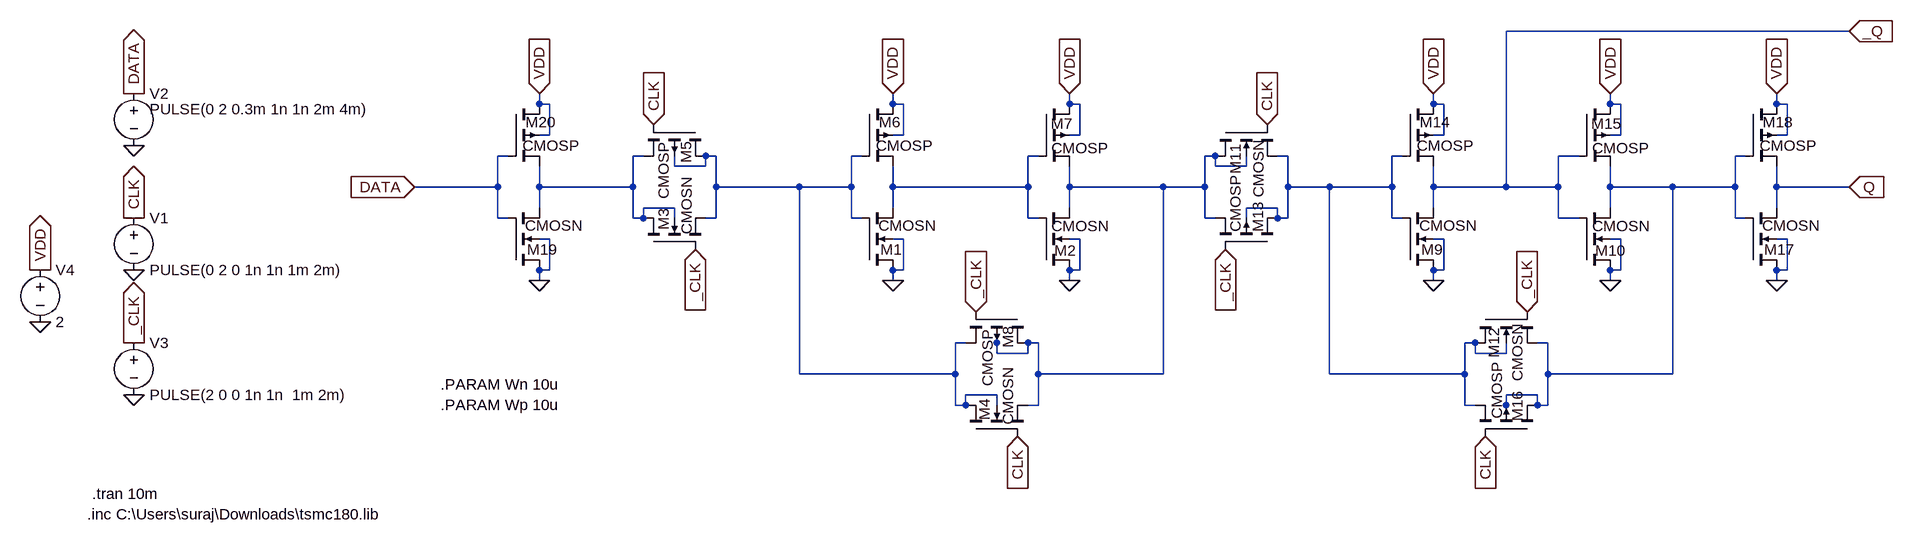
[diagram p0: schematic D_FF.asc]
D_FF.asc, the LTspice schematic file:
Version 4
SHEET 1 1920 680
WIRE 1808 -128 1280 -128
WIRE -208 -16 -208 -32
WIRE -192 -16 -208 -16
WIRE 336 -16 336 -32
WIRE 352 -16 336 -16
WIRE 608 -16 608 -32
WIRE 624 -16 608 -16
WIRE 1168 -16 1168 -32
WIRE 1184 -16 1168 -16
WIRE 1440 -16 1440 -32
WIRE 1456 -16 1440 -16
WIRE 1696 -16 1696 -32
WIRE 1712 -16 1696 -16
WIRE -208 0 -208 -16
WIRE 336 0 336 -16
WIRE 608 0 608 -16
WIRE 1168 0 1168 -16
WIRE 1440 0 1440 -16
WIRE 1696 0 1696 -16
WIRE -192 32 -192 -16
WIRE -192 32 -208 32
WIRE 352 32 352 -16
WIRE 352 32 336 32
WIRE 624 32 624 -16
WIRE 624 32 608 32
WIRE 1184 32 1184 -16
WIRE 1184 32 1168 32
WIRE 1456 32 1456 -16
WIRE 1456 32 1440 32
WIRE 1712 32 1712 -16
WIRE 1712 32 1696 32
WIRE -256 64 -272 64
WIRE -48 64 -64 64
WIRE 64 64 48 64
WIRE 288 64 272 64
WIRE 560 64 544 64
WIRE 832 64 816 64
WIRE 944 64 928 64
WIRE 1120 64 1104 64
WIRE 1392 64 1360 64
WIRE 1648 64 1632 64
WIRE 0 80 0 64
WIRE 48 80 48 64
WIRE 48 80 0 80
WIRE 832 80 832 64
WIRE 880 80 880 64
WIRE 880 80 832 80
WIRE -272 112 -272 64
WIRE -272 112 -400 112
WIRE -208 112 -208 80
WIRE -64 112 -64 64
WIRE -64 112 -208 112
WIRE 64 112 64 64
WIRE 192 112 64 112
WIRE 272 112 272 64
WIRE 272 112 192 112
WIRE 336 112 336 80
WIRE 544 112 544 64
WIRE 544 112 336 112
WIRE 608 112 608 80
WIRE 752 112 608 112
WIRE 816 112 816 64
WIRE 816 112 752 112
WIRE 944 112 944 64
WIRE 1008 112 944 112
WIRE 1104 112 1104 64
WIRE 1104 112 1008 112
WIRE 1168 112 1168 80
WIRE 1280 112 1280 -128
WIRE 1280 112 1168 112
WIRE 1360 112 1360 64
WIRE 1360 112 1280 112
WIRE 1440 112 1440 80
WIRE 1536 112 1440 112
WIRE 1632 112 1632 64
WIRE 1632 112 1536 112
WIRE 1696 112 1696 80
WIRE 1808 112 1696 112
WIRE -208 144 -208 112
WIRE 0 144 -48 144
WIRE 336 144 336 112
WIRE 608 144 608 112
WIRE 928 144 880 144
WIRE 1168 144 1168 112
WIRE 1440 144 1440 112
WIRE 1696 144 1696 112
WIRE -272 160 -272 112
WIRE -256 160 -272 160
WIRE -64 160 -64 112
WIRE -48 160 -48 144
WIRE -48 160 -64 160
WIRE 0 160 0 144
WIRE 64 160 64 112
WIRE 64 160 48 160
WIRE 272 160 272 112
WIRE 288 160 272 160
WIRE 544 160 544 112
WIRE 560 160 544 160
WIRE 816 160 816 112
WIRE 832 160 816 160
WIRE 880 160 880 144
WIRE 928 160 928 144
WIRE 944 160 944 112
WIRE 944 160 928 160
WIRE 1104 160 1104 112
WIRE 1120 160 1104 160
WIRE 1360 160 1360 112
WIRE 1392 160 1360 160
WIRE 1632 160 1632 112
WIRE 1648 160 1632 160
WIRE -192 192 -208 192
WIRE 352 192 336 192
WIRE 624 192 608 192
WIRE 1184 192 1168 192
WIRE 1456 192 1440 192
WIRE 1712 192 1696 192
WIRE -192 240 -192 192
WIRE -192 240 -208 240
WIRE 352 240 352 192
WIRE 352 240 336 240
WIRE 608 240 608 224
WIRE 624 240 624 192
WIRE 624 240 608 240
WIRE 1184 240 1184 192
WIRE 1184 240 1168 240
WIRE 1440 240 1440 224
WIRE 1456 240 1456 192
WIRE 1456 240 1440 240
WIRE 1712 240 1712 192
WIRE 1712 240 1696 240
WIRE -208 256 -208 240
WIRE 336 256 336 240
WIRE 608 256 608 240
WIRE 1168 256 1168 240
WIRE 1440 256 1440 240
WIRE 1696 256 1696 240
WIRE 448 352 432 352
WIRE 496 352 496 336
WIRE 560 352 544 352
WIRE 1232 352 1216 352
WIRE 1344 352 1328 352
WIRE 496 368 496 352
WIRE 544 368 544 352
WIRE 544 368 496 368
WIRE 1232 368 1232 352
WIRE 1280 368 1280 352
WIRE 1280 368 1232 368
WIRE 192 400 192 112
WIRE 432 400 432 352
WIRE 432 400 192 400
WIRE 560 400 560 352
WIRE 752 400 752 112
WIRE 752 400 560 400
WIRE 1008 400 1008 112
WIRE 1216 400 1216 352
WIRE 1216 400 1008 400
WIRE 1344 400 1344 352
WIRE 1536 400 1536 112
WIRE 1536 400 1344 400
WIRE 496 432 448 432
WIRE 1328 432 1280 432
WIRE 432 448 432 400
WIRE 448 448 448 432
WIRE 448 448 432 448
WIRE 496 448 496 432
WIRE 560 448 560 400
WIRE 560 448 544 448
WIRE 1216 448 1216 400
WIRE 1232 448 1216 448
WIRE 1280 448 1280 432
WIRE 1328 448 1328 432
WIRE 1344 448 1344 400
WIRE 1344 448 1328 448
WIRE 1280 464 1280 448
FLAG 608 256 0
FLAG 336 256 0
FLAG 336 -32 VDD
IOPIN 336 -32 In
FLAG 608 -32 VDD
IOPIN 608 -32 In
FLAG -400 112 DATA
IOPIN -400 112 In
FLAG 528 496 CLK
IOPIN 528 496 In
FLAG 464 304 _CLK
IOPIN 464 304 In
FLAG 32 208 _CLK
IOPIN 32 208 In
FLAG -32 16 CLK
IOPIN -32 16 In
FLAG -832 240 0
FLAG -832 48 0
FLAG -832 -32 DATA
IOPIN -832 -32 Out
FLAG -832 160 CLK
IOPIN -832 160 Out
FLAG -832 352 _CLK
IOPIN -832 352 Out
FLAG -832 432 0
FLAG -976 320 0
FLAG -976 240 VDD
IOPIN -976 240 Out
FLAG 1440 256 0
FLAG 1168 256 0
FLAG 1168 -32 VDD
IOPIN 1168 -32 In
FLAG 1440 -32 VDD
IOPIN 1440 -32 In
FLAG 1808 -128 _Q
IOPIN 1808 -128 In
FLAG 1808 112 Q
IOPIN 1808 112 In
FLAG 1312 304 _CLK
IOPIN 1312 304 In
FLAG 1248 496 CLK
IOPIN 1248 496 In
FLAG 912 16 CLK
IOPIN 912 16 In
FLAG 848 208 _CLK
IOPIN 848 208 In
FLAG 1696 256 0
FLAG 1696 -32 VDD
IOPIN 1696 -32 In
FLAG -208 256 0
FLAG -208 -32 VDD
IOPIN -208 -32 In
SYMBOL nmos4 288 240 M180
WINDOW 0 29 32 Left 2
WINDOW 3 26 69 Left 2
SYMATTR InstName M1
SYMATTR Value CMOSN
SYMATTR Value2 l=0.18u w=Wn
SYMBOL nmos4 560 240 M180
WINDOW 0 25 30 Left 2
WINDOW 3 20 68 Left 2
SYMATTR InstName M2
SYMATTR Value CMOSN
SYMATTR Value2 l=0.18u w=Wn
SYMBOL nmos4 -48 208 R270
WINDOW 0 29 31 Left 2
WINDOW 3 23 67 Left 2
SYMATTR InstName M3
SYMATTR Value CMOSN
SYMATTR Value2 l=0.18u w=Wn
SYMBOL nmos4 448 496 R270
WINDOW 0 24 29 Left 2
WINDOW 3 18 65 Left 2
SYMATTR InstName M4
SYMATTR Value CMOSN
SYMATTR Value2 l=0.18u w=Wn
SYMBOL pmos4 48 16 R90
WINDOW 0 26 30 Left 2
WINDOW 3 27 65 Left 2
SYMATTR InstName M5
SYMATTR Value CMOSP
SYMATTR Value2 l=0.18u w=Wp
SYMBOL pmos4 288 -16 R0
WINDOW 0 27 28 Left 2
WINDOW 3 22 64 Left 2
SYMATTR InstName M6
SYMATTR Value CMOSP
SYMATTR Value2 l=0.18u w=Wp
SYMBOL pmos4 560 -16 R0
WINDOW 0 19 30 Left 2
WINDOW 3 20 68 Left 2
SYMATTR InstName M7
SYMATTR Value CMOSP
SYMATTR Value2 l=0.18u w=Wp
SYMBOL pmos4 544 304 R90
WINDOW 0 23 31 Left 2
WINDOW 3 27 62 Left 2
SYMATTR InstName M8
SYMATTR Value CMOSP
SYMATTR Value2 l=0.18u w=Wp
SYMBOL voltage -832 144 R0
WINDOW 123 0 0 Left 0
WINDOW 39 0 0 Left 0
SYMATTR InstName V1
SYMATTR Value PULSE(0 2 0 1n 1n 1m 2m)
SYMBOL voltage -832 -48 R0
WINDOW 3 24 40 Left 2
WINDOW 123 0 0 Left 0
WINDOW 39 0 0 Left 0
SYMATTR Value PULSE(0 2 0.3m 1n 1n 2m 4m)
SYMATTR InstName V2
SYMBOL voltage -832 336 R0
WINDOW 123 0 0 Left 0
WINDOW 39 0 0 Left 0
SYMATTR InstName V3
SYMATTR Value PULSE(2 0 0 1n 1n  1m 2m)
SYMBOL voltage -976 224 R0
WINDOW 123 0 0 Left 0
WINDOW 39 0 0 Left 0
SYMATTR InstName V4
SYMATTR Value 2
SYMBOL nmos4 1120 240 M180
WINDOW 0 29 32 Left 2
WINDOW 3 26 69 Left 2
SYMATTR InstName M9
SYMATTR Value CMOSN
SYMATTR Value2 l=0.18u w=Wn
SYMBOL nmos4 1392 240 M180
WINDOW 0 25 30 Left 2
WINDOW 3 20 68 Left 2
SYMATTR InstName M10
SYMATTR Value CMOSN
SYMATTR Value2 l=0.18u w=Wn
SYMBOL nmos4 832 16 M90
WINDOW 0 29 31 Left 2
WINDOW 3 23 67 Left 2
SYMATTR InstName M11
SYMATTR Value CMOSN
SYMATTR Value2 l=0.18u w=Wn
SYMBOL nmos4 1232 304 M90
WINDOW 0 24 29 Left 2
WINDOW 3 18 65 Left 2
SYMATTR InstName M12
SYMATTR Value CMOSN
SYMATTR Value2 l=0.18u w=Wn
SYMBOL pmos4 928 208 M270
WINDOW 0 26 30 Left 2
WINDOW 3 27 65 Left 2
SYMATTR InstName M13
SYMATTR Value CMOSP
SYMATTR Value2 l=0.18u w=Wp
SYMBOL pmos4 1120 -16 R0
WINDOW 0 27 28 Left 2
WINDOW 3 22 64 Left 2
SYMATTR InstName M14
SYMATTR Value CMOSP
SYMATTR Value2 l=0.18u w=Wp
SYMBOL pmos4 1392 -16 R0
WINDOW 0 19 30 Left 2
WINDOW 3 20 68 Left 2
SYMATTR InstName M15
SYMATTR Value CMOSP
SYMATTR Value2 l=0.18u w=Wp
SYMBOL pmos4 1328 496 M270
WINDOW 0 23 31 Left 2
WINDOW 3 27 62 Left 2
SYMATTR InstName M16
SYMATTR Value CMOSP
SYMATTR Value2 l=0.18u w=Wp
SYMBOL nmos4 1648 240 M180
WINDOW 0 29 32 Left 2
WINDOW 3 26 69 Left 2
SYMATTR InstName M17
SYMATTR Value CMOSN
SYMATTR Value2 l=0.18u w=Wn
SYMBOL pmos4 1648 -16 R0
WINDOW 0 27 28 Left 2
WINDOW 3 22 64 Left 2
SYMATTR InstName M18
SYMATTR Value CMOSP
SYMATTR Value2 l=0.18u w=Wp
SYMBOL nmos4 -256 240 M180
WINDOW 0 29 32 Left 2
WINDOW 3 26 69 Left 2
SYMATTR InstName M19
SYMATTR Value CMOSN
SYMATTR Value2 l=0.18u w=Wn
SYMBOL pmos4 -256 -16 R0
WINDOW 0 27 28 Left 2
WINDOW 3 22 64 Left 2
SYMATTR InstName M20
SYMATTR Value CMOSP
SYMATTR Value2 l=0.18u w=Wp
TEXT -904 616 Left 2 !.inc C:\\Users\\suraj\\Downloads\\tsmc180.lib
TEXT -896 584 Left 2 !.tran 10m
TEXT -360 416 Left 2 !.PARAM Wn 10u\n.PARAM Wp 10u

The netlist it stands for:
* D_FF.asc
M1 0 N002 N003 0 CMOSN l=0.18u w=Wn
M2 0 N003 N004 0 CMOSN l=0.18u w=Wn
M3 N001 _CLK N002 N001 CMOSN l=0.18u w=Wn
M4 N002 CLK N004 N002 CMOSN l=0.18u w=Wn
M5 N002 CLK N001 N002 CMOSP l=0.18u w=Wp
M6 VDD N002 N003 VDD CMOSP l=0.18u w=Wp
M7 VDD N003 N004 VDD CMOSP l=0.18u w=Wp
M8 N004 _CLK N002 N004 CMOSP l=0.18u w=Wp
V1 CLK 0 PULSE(0 2 0 1n 1n 1m 2m)
V2 DATA 0 PULSE(0 2 0.3m 1n 1n 2m 4m)
V3 _CLK 0 PULSE(2 0 0 1n 1n  1m 2m)
V4 VDD 0 2
M9 0 N005 _Q 0 CMOSN l=0.18u w=Wn
M10 0 _Q N006 0 CMOSN l=0.18u w=Wn
M11 N004 CLK N005 N004 CMOSN l=0.18u w=Wn
M12 N005 _CLK N006 N005 CMOSN l=0.18u w=Wn
M13 N005 _CLK N004 N005 CMOSP l=0.18u w=Wp
M14 VDD N005 _Q VDD CMOSP l=0.18u w=Wp
M15 VDD _Q N006 VDD CMOSP l=0.18u w=Wp
M16 N006 CLK N005 N006 CMOSP l=0.18u w=Wp
M17 0 N006 Q 0 CMOSN l=0.18u w=Wn
M18 VDD N006 Q VDD CMOSP l=0.18u w=Wp
M19 0 DATA N001 0 CMOSN l=0.18u w=Wn
M20 VDD DATA N001 VDD CMOSP l=0.18u w=Wp
.model NMOS NMOS
.model PMOS PMOS
.lib standard.mos
.inc C:\Users\suraj\Downloads\tsmc180.lib
.tran 10m
.PARAM Wn 10u
.PARAM Wp 10u
.backanno
.end